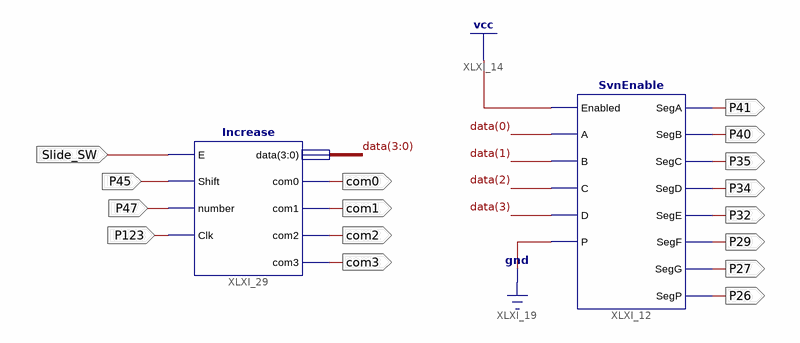
[diagram p0: schematic sheet 1]
// Xilinx ISE schematic Test.sch (spartan6) as structural Verilog: 2 symbols, 16 ports
module Test (
  input  P47,
  input  P123,
  input  Slide_SW,
  input  P45,
  output com0,
  output com1,
  output com2,
  output com3,
  output P41,
  output P40,
  output P35,
  output P34,
  output P32,
  output P29,
  output P27,
  output P26
);

  wire [3:0] data;

  SvnEnable XLXI_12 (
    .A(data[0]), .B(data[1]), .C(data[2]), .D(data[3]), .Enabled(1'b1), .P(1'b0), .SegA(P41), .SegB(P40),
    .SegC(P35), .SegD(P34), .SegE(P32), .SegF(P29), .SegG(P27), .SegP(P26));
  Increase XLXI_29 (
    .Clk(P123), .com0(com0), .com1(com1), .com2(com2), .com3(com3), .data(data), .E(Slide_SW), .number(P47),
    .Shift(P45));

  // Notes on the sheet:
  //   CLOCK_DEDICATED_ROUTE on signal Slide_SW = FALSE
  //   CLOCK_DEDICATED_ROUTE on signal P45 = FALSE
endmodule
